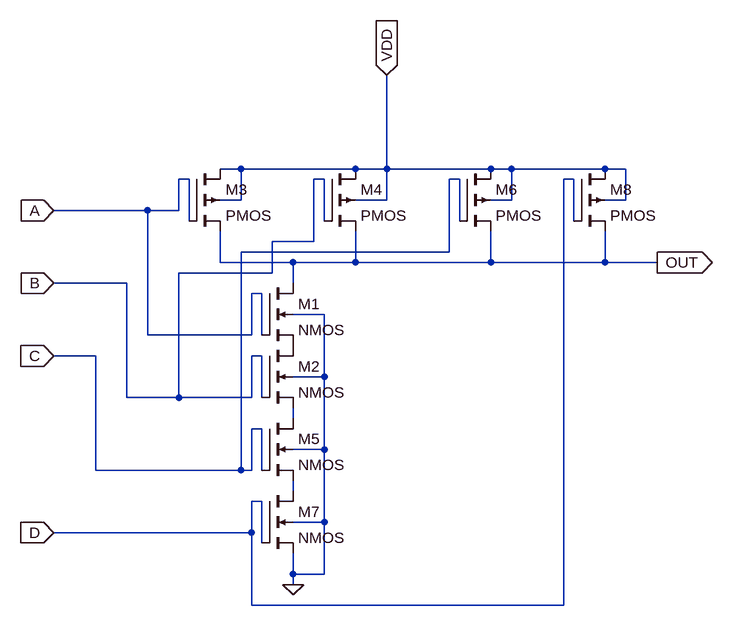
[diagram p0: schematic nand4.asc]
nand4.asc, the LTspice schematic file:
Version 4
SHEET 1 880 680
WIRE -48 -16 -80 -16
WIRE 128 -16 -48 -16
WIRE 176 -16 176 -160
WIRE 176 -16 128 -16
WIRE 336 -16 176 -16
WIRE 368 -16 336 -16
WIRE 512 -16 368 -16
WIRE 544 -16 512 -16
WIRE -128 0 -144 0
WIRE 80 0 64 0
WIRE 288 0 272 0
WIRE 464 0 448 0
WIRE -48 32 -48 -16
WIRE -48 32 -80 32
WIRE 176 32 176 -16
WIRE 176 32 128 32
WIRE 368 32 368 -16
WIRE 368 32 336 32
WIRE 544 32 544 -16
WIRE 544 32 512 32
WIRE -192 48 -336 48
WIRE -144 48 -144 0
WIRE -144 48 -192 48
WIRE -128 64 -128 0
WIRE 80 64 80 0
WIRE 288 64 288 0
WIRE 464 64 464 0
WIRE 64 96 64 0
WIRE 64 96 0 96
WIRE 272 112 272 0
WIRE 272 112 -48 112
WIRE -80 128 -80 80
WIRE 32 128 -80 128
WIRE 128 128 128 80
WIRE 128 128 32 128
WIRE 336 128 336 80
WIRE 336 128 128 128
WIRE 512 128 512 80
WIRE 512 128 336 128
WIRE 592 128 512 128
WIRE 0 144 0 96
WIRE 0 144 -144 144
WIRE -224 160 -336 160
WIRE 32 160 32 128
WIRE -16 176 -32 176
WIRE 80 208 32 208
WIRE -192 240 -192 48
WIRE -32 240 -32 176
WIRE -32 240 -192 240
WIRE -16 240 -16 176
WIRE -272 272 -336 272
WIRE -16 272 -32 272
WIRE 80 304 80 208
WIRE 80 304 32 304
WIRE -224 336 -224 160
WIRE -144 336 -144 144
WIRE -144 336 -224 336
WIRE -32 336 -32 272
WIRE -32 336 -144 336
WIRE -16 336 -16 272
WIRE 32 368 32 352
WIRE -16 384 -32 384
WIRE 80 416 80 304
WIRE 80 416 32 416
WIRE -272 448 -272 272
WIRE -48 448 -48 112
WIRE -48 448 -272 448
WIRE -32 448 -32 384
WIRE -32 448 -48 448
WIRE -16 448 -16 384
WIRE 32 480 32 464
WIRE -16 496 -32 496
WIRE 80 528 80 416
WIRE 80 528 32 528
WIRE -32 544 -32 496
WIRE -32 544 -336 544
WIRE -16 560 -16 496
WIRE 32 608 32 576
WIRE 80 608 80 528
WIRE 80 608 32 608
WIRE 32 624 32 608
WIRE -32 656 -32 544
WIRE 448 656 448 0
WIRE 448 656 -32 656
FLAG -336 48 A
IOPIN -336 48 In
FLAG -336 160 B
IOPIN -336 160 In
FLAG -336 272 C
IOPIN -336 272 In
FLAG 32 624 0
FLAG 592 128 OUT
IOPIN 592 128 Out
FLAG -336 544 D
IOPIN -336 544 In
FLAG 176 -160 VDD
IOPIN 176 -160 In
SYMBOL nmos4 -16 160 R0
SYMATTR InstName M1
SYMATTR Value2 l=90n w=200n
SYMBOL nmos4 -16 256 R0
SYMATTR InstName M2
SYMATTR Value2 l=90n w=200n
SYMBOL pmos4 -128 -16 R0
SYMATTR InstName M3
SYMATTR Value2 l=90n w=400n
SYMBOL pmos4 80 -16 R0
SYMATTR InstName M4
SYMATTR Value2 l=90n w=400n
SYMBOL nmos4 -16 368 R0
SYMATTR InstName M5
SYMATTR Value2 l=90n w=200n
SYMBOL nmos4 -16 480 R0
SYMATTR InstName M7
SYMATTR Value2 l=90n w=200n
SYMBOL pmos4 288 -16 R0
SYMATTR InstName M6
SYMATTR Value2 l=90n w=400n
SYMBOL pmos4 464 -16 R0
SYMATTR InstName M8
SYMATTR Value2 l=90n w=400n

The netlist it stands for:
* nand4.asc
M1 OUT A P001 0 NMOS l=90n w=200n
M2 P001 B N001 0 NMOS l=90n w=200n
M3 VDD A OUT VDD PMOS l=90n w=400n
M4 VDD B OUT VDD PMOS l=90n w=400n
M5 N001 C N002 0 NMOS l=90n w=200n
M7 N002 D 0 0 NMOS l=90n w=200n
M6 VDD C OUT VDD PMOS l=90n w=400n
M8 VDD D OUT VDD PMOS l=90n w=400n
.model NMOS NMOS
.model PMOS PMOS
.lib standard.mos
.backanno
.end